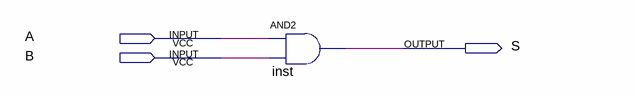
[diagram p0: schematic sheet]
// Quartus schematic AND.bdf as structural Verilog: 1 symbols, 3 pins
module AND (
  input  A,
  input  B,
  output S
);

  and inst (S, A, B);
endmodule
